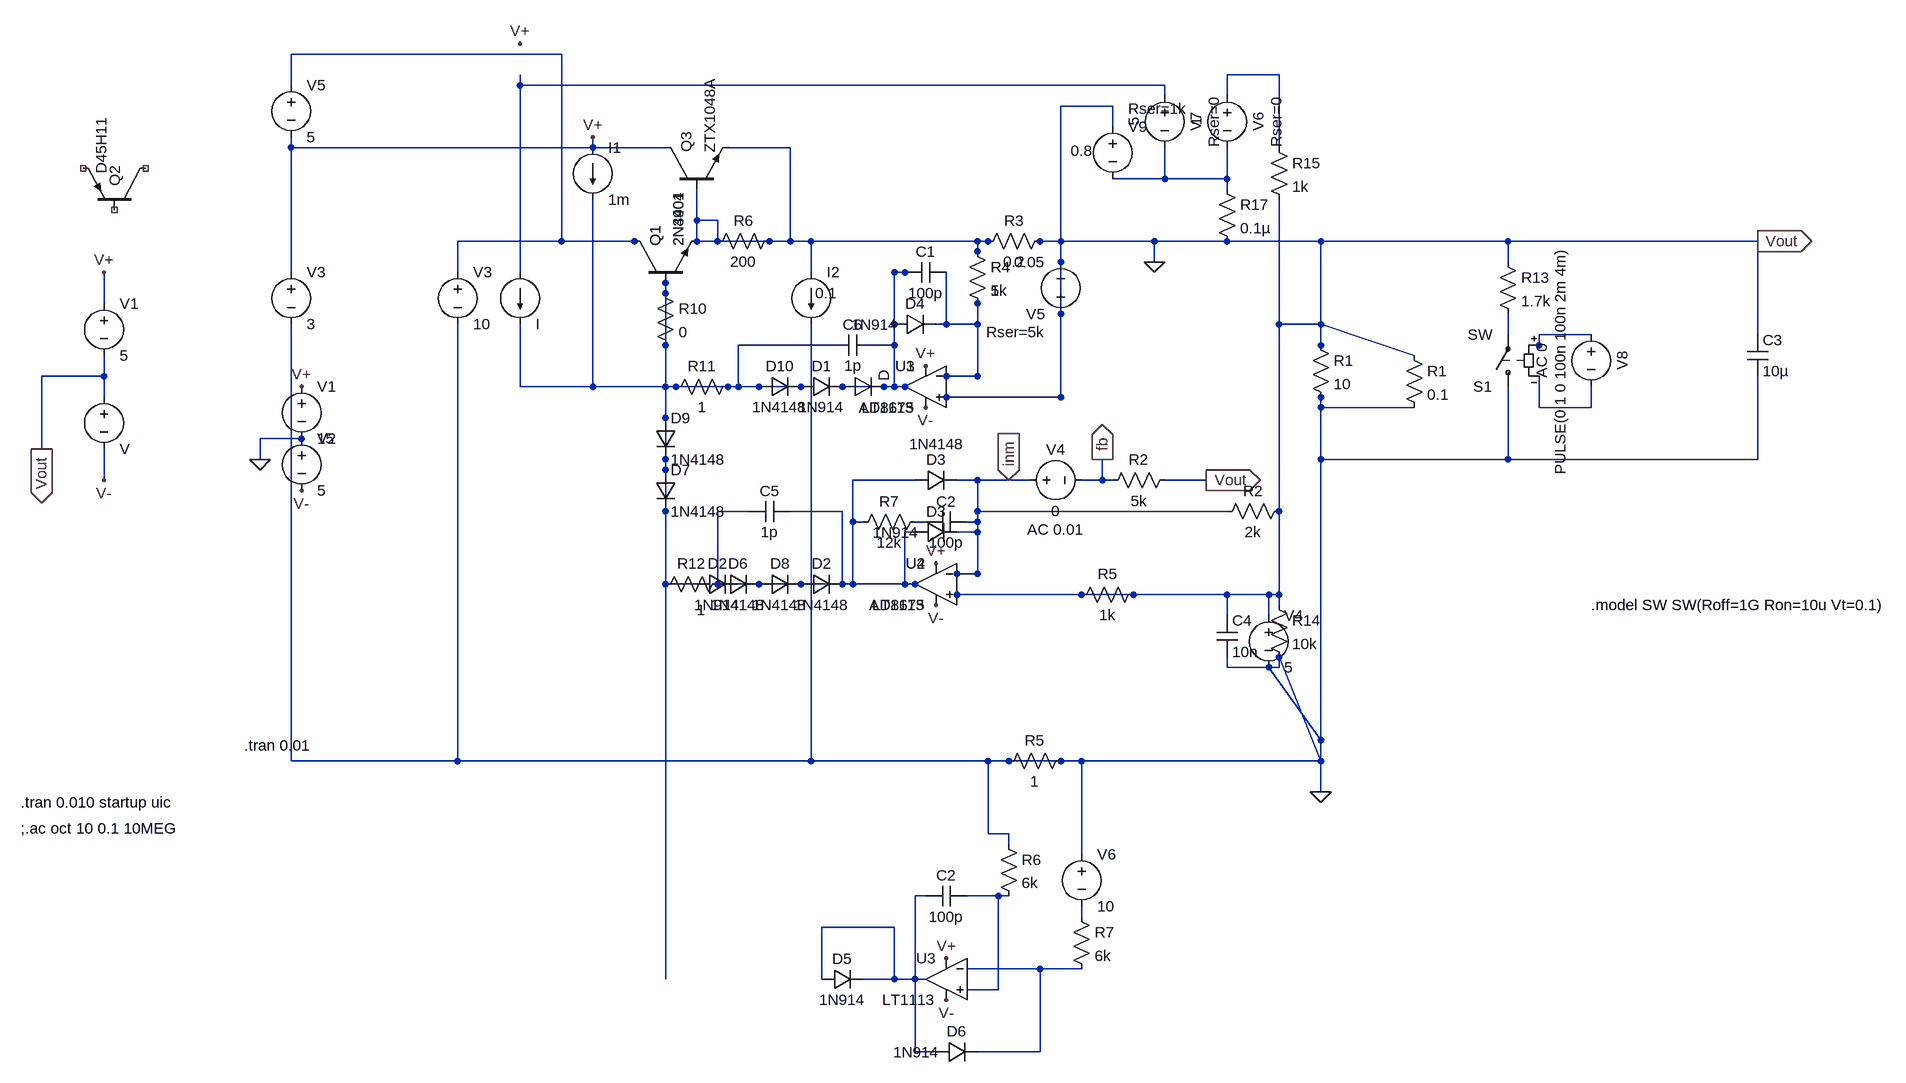
[diagram p0: schematic blackdog_experiments.asc]
blackdog_experiments.asc, the LTspice schematic file:
Version 4
<<<<<<< HEAD
SHEET 1 2384 1220
WIRE 96 -416 -320 -416
WIRE 1200 -384 1120 -384
WIRE -320 -368 -320 -416
WIRE 32 -368 32 -384
WIRE 1024 -368 32 -368
WIRE 1024 -352 1024 -368
WIRE 1120 -352 1120 -384
WIRE 944 -336 864 -336
WIRE 944 -304 944 -336
WIRE -320 -272 -320 -288
WIRE 256 -272 -320 -272
WIRE 448 -272 352 -272
WIRE 1200 -272 1200 -384
WIRE 1024 -224 1024 -272
WIRE 1024 -224 944 -224
WIRE 1120 -224 1120 -272
WIRE 1120 -224 1024 -224
WIRE 1120 -208 1120 -224
WIRE 304 -160 304 -208
WIRE 336 -160 304 -160
WIRE 96 -128 96 -416
WIRE 208 -128 96 -128
WIRE 304 -128 304 -160
WIRE 336 -128 336 -160
WIRE 448 -128 448 -272
WIRE 448 -128 416 -128
WIRE 480 -128 448 -128
WIRE 736 -128 480 -128
WIRE 752 -128 736 -128
WIRE 1008 -128 832 -128
WIRE 1120 -128 1008 -128
WIRE 1264 -128 1120 -128
WIRE 1552 -128 1264 -128
WIRE 1936 -128 1552 -128
WIRE 736 -112 736 -128
WIRE 1008 -96 1008 -128
WIRE 1552 -96 1552 -128
WIRE -320 -80 -320 -272
WIRE 32 -80 32 -368
WIRE 480 -80 480 -128
WIRE 624 -80 608 -80
WIRE 256 -48 256 -64
WIRE -608 -32 -608 -80
=======
SHEET 1 1332 1220
WIRE 144 -272 144 -288
WIRE 208 -128 -64 -128
WIRE 736 -128 304 -128
WIRE 752 -128 736 -128
WIRE 864 -128 832 -128
WIRE 1264 -128 864 -128
WIRE 736 -112 736 -128
WIRE 864 -96 864 -128
WIRE -64 -80 -64 -128
WIRE 624 -80 608 -80
>>>>>>> 6c758090dd1eeeb20fed47f8386ac39ac4c47e26
WIRE 608 0 608 -80
WIRE 688 0 688 -80
WIRE 688 0 672 0
WIRE 736 0 736 -32
WIRE 736 0 688 0
WIRE 1264 0 1264 -128
<<<<<<< HEAD
WIRE 1552 16 1552 -16
WIRE 1680 16 1600 16
WIRE 1936 16 1936 -128
WIRE 512 32 368 32
WIRE 608 32 608 0
WIRE 608 32 576 32
WIRE 1264 32 1264 0
WIRE 1600 32 1600 16
WIRE 1600 32 1584 32
WIRE 1408 48 1264 0
WIRE -608 80 -608 48
WIRE -608 80 -704 80
WIRE 736 80 736 0
WIRE 736 80 688 80
WIRE 32 96 32 0
WIRE 256 96 256 32
WIRE 256 96 32 96
WIRE 272 96 256 96
WIRE 368 96 368 32
WIRE 368 96 352 96
WIRE 400 96 368 96
WIRE 608 96 608 32
WIRE 608 96 592 96
WIRE 624 96 608 96
WIRE -608 112 -608 80
WIRE 864 112 864 -336
WIRE 864 112 688 112
WIRE 1264 128 1264 112
WIRE 1408 128 1264 128
WIRE 1600 128 1600 80
WIRE 1680 128 1680 96
WIRE 1680 128 1600 128
WIRE 256 144 256 96
WIRE -704 192 -704 80
WIRE 1264 208 1264 128
WIRE 1552 208 1552 96
WIRE 1552 208 1264 208
WIRE 1936 208 1936 80
WIRE 1936 208 1552 208
WIRE 256 224 256 208
WIRE -608 240 -608 192
WIRE 640 240 544 240
WIRE 736 240 704 240
WIRE 784 240 736 240
WIRE 816 240 784 240
WIRE 928 240 928 208
WIRE 928 240 896 240
WIRE 944 240 928 240
WIRE 1088 240 1024 240
WIRE 384 288 336 288
WIRE 528 288 448 288
WIRE 544 304 544 240
WIRE 560 304 544 304
WIRE 656 304 640 304
WIRE 736 304 736 240
WIRE 736 304 720 304
WIRE 736 384 736 304
WIRE 736 384 704 384
WIRE 256 400 256 288
WIRE 336 400 336 288
WIRE 528 400 528 288
WIRE 544 400 544 304
WIRE 544 400 528 400
WIRE 640 400 544 400
WIRE 896 416 704 416
WIRE 1120 416 976 416
WIRE 1200 416 1200 -192
WIRE 1200 416 1120 416
WIRE 1200 432 1200 416
WIRE 1120 448 1120 416
WIRE 1120 528 1120 512
WIRE 1200 528 1200 512
WIRE 1200 528 1120 528
WIRE -320 672 -320 0
WIRE 480 672 480 0
WIRE 480 672 -320 672
WIRE 1264 672 1264 208
WIRE 1264 672 1200 512
WIRE 1264 672 480 672
WIRE 1264 720 1264 672
FLAG -608 -80 V+
FLAG -608 240 V-
FLAG 32 -432 V+
=======
WIRE 1264 0 1200 0
WIRE 1264 32 1264 0
WIRE 736 80 736 0
WIRE 736 80 688 80
WIRE 144 96 144 -192
WIRE 256 96 256 -64
WIRE 256 96 144 96
WIRE 464 96 256 96
WIRE 608 96 608 0
WIRE 608 96 528 96
WIRE 624 96 608 96
WIRE 864 112 864 -16
WIRE 864 112 688 112
WIRE -304 176 -368 176
WIRE -368 208 -368 176
WIRE 1120 288 736 288
WIRE 1200 288 1200 0
WIRE 640 320 624 320
WIRE 736 320 736 288
WIRE 736 320 704 320
WIRE 736 384 736 320
WIRE 736 384 704 384
WIRE 256 400 256 96
WIRE 304 400 256 400
WIRE 624 400 624 320
WIRE 624 400 368 400
WIRE 640 400 624 400
WIRE 1184 416 704 416
WIRE 1184 448 1184 416
WIRE 1264 640 1264 112
WIRE 1264 640 1184 528
WIRE -64 672 -64 0
WIRE 752 672 -64 672
WIRE 784 672 752 672
WIRE 896 672 864 672
WIRE 1264 672 1264 640
WIRE 1264 672 896 672
WIRE 1264 720 1264 672
WIRE 752 784 752 672
WIRE 784 784 752 784
WIRE 784 800 784 784
WIRE 896 816 896 672
WIRE 656 880 640 880
WIRE 768 880 720 880
WIRE 784 880 768 880
WIRE 896 912 896 896
WIRE 608 928 496 928
WIRE 832 992 720 992
WIRE 896 992 832 992
WIRE 256 1008 256 400
WIRE 496 1008 496 928
WIRE 608 1008 608 928
WIRE 608 1008 560 1008
WIRE 640 1008 640 880
WIRE 640 1008 608 1008
WIRE 656 1008 640 1008
WIRE 768 1024 768 880
WIRE 768 1024 720 1024
WIRE 640 1120 640 1008
WIRE 672 1120 640 1120
WIRE 832 1120 832 992
WIRE 832 1120 736 1120
FLAG -368 208 0
FLAG -304 96 V+
FLAG -304 256 V-
FLAG 144 -288 V+
FLAG 1264 720 0
>>>>>>> 6c758090dd1eeeb20fed47f8386ac39ac4c47e26
FLAG 656 64 V+
FLAG 672 368 V+
FLAG 672 432 V-
FLAG 656 128 V-
<<<<<<< HEAD
FLAG 928 208 fb
IOPIN 928 208 Out
FLAG 784 240 inm
IOPIN 784 240 In
FLAG 1936 -128 Vout
IOPIN 1936 -128 Out
FLAG -704 192 Vout
IOPIN -704 192 Out
FLAG 1088 240 Vout
IOPIN 1088 240 Out
FLAG 1008 -96 0
SYMBOL voltage -608 -48 R0
WINDOW 123 0 0 Left 0
WINDOW 39 0 0 Left 0
SYMATTR InstName V1
SYMATTR Value 5
SYMBOL voltage -608 96 R0
=======
FLAG 688 976 V+
FLAG 688 1040 V-
SYMBOL voltage -304 80 R0
WINDOW 123 0 0 Left 0
WINDOW 39 0 0 Left 0
SYMATTR InstName V1
SYMATTR Value 15
SYMBOL voltage -304 160 R0
>>>>>>> 6c758090dd1eeeb20fed47f8386ac39ac4c47e26
WINDOW 123 0 0 Left 0
WINDOW 39 0 0 Left 0
SYMATTR InstName V2
SYMATTR Value 5
<<<<<<< HEAD
SYMBOL npn 208 -64 R270
SYMATTR InstName Q1
SYMATTR Value 2N4401
SYMBOL voltage -320 -96 R0
WINDOW 123 0 0 Left 0
WINDOW 39 0 0 Left 0
SYMATTR InstName V3
SYMATTR Value 3
SYMBOL current 32 -80 R0
=======
SYMBOL Opamps\\LT1113 656 32 M0
SYMATTR InstName U1
SYMBOL Opamps\\LT1113 672 336 M0
SYMATTR InstName U2
SYMBOL npn 208 -64 R270
SYMATTR InstName Q1
SYMATTR Value 2N3904
SYMBOL voltage -64 -96 R0
WINDOW 123 0 0 Left 0
WINDOW 39 0 0 Left 0
SYMATTR InstName V3
SYMATTR Value 10
SYMBOL current 144 -272 R0
>>>>>>> 6c758090dd1eeeb20fed47f8386ac39ac4c47e26
WINDOW 123 0 0 Left 0
WINDOW 39 0 0 Left 0
SYMATTR InstName I1
SYMATTR Value 1m
SYMBOL diode 464 112 R270
WINDOW 0 32 32 VTop 2
WINDOW 3 0 32 VBottom 2
SYMATTR InstName D1
SYMATTR Value 1N914
<<<<<<< HEAD
SYMBOL diode 464 416 R270
WINDOW 0 32 32 VTop 2
WINDOW 3 0 32 VBottom 2
SYMATTR InstName D2
SYMATTR Value 1N4148
SYMBOL res 1392 32 R0
SYMATTR InstName R1
SYMATTR Value 0.1
SYMBOL diode 640 256 R270
WINDOW 0 32 32 VTop 2
WINDOW 3 87 33 VBottom 2
SYMATTR InstName D3
SYMATTR Value 1N4148
SYMBOL res 1040 224 R90
WINDOW 0 0 56 VBottom 2
WINDOW 3 32 56 VTop 2
SYMATTR InstName R2
SYMATTR Value 5k
=======
SYMBOL diode 304 416 R270
WINDOW 0 32 32 VTop 2
WINDOW 3 0 32 VBottom 2
SYMATTR InstName D2
SYMATTR Value 1N914
SYMBOL res 1248 16 R0
SYMATTR InstName R1
SYMATTR Value 10
SYMBOL voltage 1184 432 R0
WINDOW 123 0 0 Left 0
WINDOW 39 0 0 Left 0
SYMATTR InstName V4
SYMATTR Value 5
SYMBOL diode 640 336 R270
WINDOW 0 32 32 VTop 2
WINDOW 3 31 -30 VBottom 2
SYMATTR InstName D3
SYMATTR Value 1N914
SYMBOL res 1216 272 R90
WINDOW 0 0 56 VBottom 2
WINDOW 3 32 56 VTop 2
SYMATTR InstName R2
SYMATTR Value 2k
>>>>>>> 6c758090dd1eeeb20fed47f8386ac39ac4c47e26
SYMBOL res 736 -112 R270
WINDOW 0 32 56 VTop 2
WINDOW 3 0 56 VBottom 2
SYMATTR InstName R3
<<<<<<< HEAD
SYMATTR Value 0.2
SYMBOL res 720 -128 R0
SYMATTR InstName R4
SYMATTR Value 1k
=======
SYMATTR Value 1
SYMBOL res 720 -128 R0
SYMATTR InstName R4
SYMATTR Value 5k
SYMBOL voltage 864 0 R180
WINDOW 123 0 0 Left 0
WINDOW 39 24 -12 Left 2
SYMATTR SpiceLine Rser=5k
SYMATTR InstName V5
SYMATTR Value 0.05
>>>>>>> 6c758090dd1eeeb20fed47f8386ac39ac4c47e26
SYMBOL diode 608 16 R270
WINDOW 0 32 32 VTop 2
WINDOW 3 31 -30 VBottom 2
SYMATTR InstName D4
SYMATTR Value 1N914
SYMBOL cap 688 -96 R90
WINDOW 0 0 32 VBottom 2
WINDOW 3 32 32 VTop 2
SYMATTR InstName C1
SYMATTR Value 100p
<<<<<<< HEAD
SYMBOL pnp -544 -176 M270
WINDOW 0 36 47 Left 2
SYMATTR InstName Q2
SYMATTR Value D45H11
SYMBOL res 240 -64 R0
SYMATTR InstName R10
SYMATTR Value 0
SYMBOL res 368 80 R90
WINDOW 0 0 56 VBottom 2
WINDOW 3 32 56 VTop 2
SYMATTR InstName R11
SYMATTR Value 1
SYMBOL res 352 384 R90
WINDOW 0 0 56 VBottom 2
WINDOW 3 40 41 VTop 2
SYMATTR InstName R12
SYMATTR Value 1
SYMBOL cap 1920 16 R0
SYMATTR InstName C3
SYMATTR Value 10µ
SYMATTR SpiceLine Rser=0.1
SYMBOL Opamps\\AD8675 656 32 M0
SYMATTR InstName U3
SYMBOL Opamps\\AD8675 672 336 M0
SYMATTR InstName U4
SYMBOL res 656 288 R90
WINDOW 0 0 56 VBottom 2
WINDOW 3 32 56 VTop 2
SYMATTR InstName R7
SYMATTR Value 12k
SYMBOL cap 720 288 R90
WINDOW 0 0 32 VBottom 2
WINDOW 3 32 32 VTop 2
SYMATTR InstName C2
SYMATTR Value 100p
SYMBOL voltage 800 240 R270
WINDOW 0 32 56 VTop 2
WINDOW 3 -32 56 VBottom 2
WINDOW 123 -60 56 VBottom 2
WINDOW 39 0 0 Left 0
SYMATTR InstName V4
SYMATTR Value 0
SYMATTR Value2 AC 0.01
SYMBOL voltage 1120 -368 R0
WINDOW 0 32 56 VTop 2
WINDOW 3 -32 56 VBottom 2
WINDOW 123 -60 56 VBottom 2
WINDOW 39 60 56 VTop 2
SYMATTR InstName V6
SYMATTR Value 1
SYMATTR SpiceLine Rser=0
SYMBOL current 480 -80 R0
WINDOW 3 6 32 Left 2
WINDOW 123 0 0 Left 0
WINDOW 39 0 0 Left 0
SYMATTR Value 0.1
SYMATTR InstName I2
SYMBOL sw 1552 112 R180
SYMATTR InstName S1
SYMBOL voltage 1680 0 R0
WINDOW 0 32 56 VTop 2
WINDOW 3 -32 56 VBottom 2
WINDOW 123 -60 56 VBottom 2
WINDOW 39 0 0 Left 0
SYMATTR InstName V8
SYMATTR Value PULSE(0 1 0 100n 100n 2m 4m)
SYMATTR Value2 AC 0
SYMBOL res 1536 -112 R0
SYMATTR InstName R13
SYMATTR Value 1.7k
SYMBOL res 1184 -288 R0
SYMATTR InstName R15
SYMATTR Value 1k
SYMBOL res 1184 416 R0
SYMATTR InstName R14
SYMATTR Value 10k
SYMBOL diode 336 416 R270
WINDOW 0 32 32 VTop 2
WINDOW 3 0 32 VBottom 2
SYMATTR InstName D6
SYMATTR Value 1N4148
SYMBOL voltage 1024 -368 R0
WINDOW 0 32 56 VTop 2
WINDOW 3 -32 56 VBottom 2
WINDOW 123 -60 56 VBottom 2
WINDOW 39 60 56 VTop 2
SYMATTR InstName V7
SYMATTR Value 5
SYMATTR SpiceLine Rser=0
SYMBOL res 1104 -224 R0
SYMATTR InstName R17
SYMATTR Value 0.1µ
SYMBOL voltage 944 -320 R0
WINDOW 123 0 0 Left 0
WINDOW 39 24 -12 Left 2
WINDOW 3 -65 53 Left 2
SYMATTR SpiceLine Rser=1k
SYMATTR Value 0.8
SYMATTR InstName V9
SYMBOL diode 400 416 R270
WINDOW 0 32 32 VTop 2
WINDOW 3 0 32 VBottom 2
SYMATTR InstName D8
SYMATTR Value 1N4148
SYMBOL diode 528 112 R270
=======
SYMBOL res 880 656 R90
WINDOW 0 0 56 VBottom 2
WINDOW 3 32 56 VTop 2
SYMATTR InstName R5
SYMATTR Value 1
SYMBOL Opamps\\LT1113 688 944 M0
SYMATTR InstName U3
SYMBOL diode 496 1024 R270
>>>>>>> 6c758090dd1eeeb20fed47f8386ac39ac4c47e26
WINDOW 0 32 32 VTop 2
WINDOW 3 0 32 VBottom 2
SYMATTR InstName D5
SYMATTR Value 1N914
<<<<<<< HEAD
SYMBOL cap 1104 448 R0
SYMATTR InstName C4
SYMATTR Value 10n
SYMBOL npn 256 -208 R270
SYMATTR InstName Q3
SYMATTR Value ZTX1048A
SYMBOL res 432 -144 R90
WINDOW 0 0 56 VBottom 2
WINDOW 3 32 56 VTop 2
SYMATTR InstName R6
SYMATTR Value 200
SYMBOL diode 240 224 R0
SYMATTR InstName D7
SYMATTR Value 1N4148
SYMBOL diode 240 144 R0
SYMATTR InstName D9
SYMATTR Value 1N4148
SYMBOL voltage -320 -384 R0
WINDOW 123 0 0 Left 0
WINDOW 39 0 0 Left 0
SYMATTR InstName V5
SYMATTR Value 5
SYMBOL cap 448 272 R90
WINDOW 0 0 32 VBottom 2
WINDOW 3 32 32 VTop 2
SYMATTR InstName C5
SYMATTR Value 1p
SYMBOL cap 576 16 R90
WINDOW 0 0 32 VBottom 2
WINDOW 3 32 32 VTop 2
SYMATTR InstName C6
SYMATTR Value 1p
SYMBOL res 992 400 R90
WINDOW 0 0 56 VBottom 2
WINDOW 3 32 56 VTop 2
SYMATTR InstName R5
SYMATTR Value 1k
SYMBOL diode 400 112 R270
WINDOW 0 32 32 VTop 2
WINDOW 3 0 32 VBottom 2
SYMATTR InstName D10
SYMATTR Value 1N4148
TEXT -736 736 Left 2 !.tran 0.010 startup uic
TEXT -736 776 Left 2 !;.ac oct 10 0.1 10MEG
TEXT 1680 432 Left 2 !.model SW SW(Roff=1G Ron=10u Vt=0.1)
=======
SYMBOL voltage 896 800 R0
WINDOW 123 0 0 Left 0
WINDOW 39 0 0 Left 0
SYMATTR InstName V6
SYMATTR Value 10
SYMBOL cap 720 864 R90
WINDOW 0 0 32 VBottom 2
WINDOW 3 32 32 VTop 2
SYMATTR InstName C2
SYMATTR Value 100p
SYMBOL res 768 784 R0
SYMATTR InstName R6
SYMATTR Value 6k
SYMBOL diode 672 1136 R270
WINDOW 0 32 32 VTop 2
WINDOW 3 31 -30 VBottom 2
SYMATTR InstName D6
SYMATTR Value 1N914
SYMBOL res 880 896 R0
SYMATTR InstName R7
SYMATTR Value 6k
TEXT -392 648 Left 2 !.tran 0.01
>>>>>>> 6c758090dd1eeeb20fed47f8386ac39ac4c47e26

The netlist it stands for:
* blackdog_experiments.asc
V1 V+ 0 5
V§? 0 V- V
V1 V+ 0 15
V2 0 V- 5
Q1 N001 N007 N004 0 2N4401
V3 V+ 0 3
I§? N003 N007 I
XU1 0 N008 V+ V- N006 LT1113  ; pins In+ In- V+ V- OUT
XU2 0 inm V+ V- N012 LT1113  ; pins In+ In- V+ V- OUT
Q1 N001 N007 N004 0 2N3904
V3 N001 0 10
I1 V+ N007 1m
D1 N007 N006 1N914
D2 N012 N012 1N4148
R1 0 0 0.1
D3 N012 inm 1N4148
R2 0 fb 5k
D2 N007 N012 1N914
R1 0 0 10
V4 0 0 5
D3 N012 inm 1N914
R2 0 inm 2k
R3 N004 0 0.2
R4 N004 N008 1
R4 N004 N008 5k
V5 0 0 0.05 Rser=5k
D4 N006 N008 1N914
C1 N008 N006 100p
Q2 NC_01 NC_02 NC_03 0 D45H11
R10 N007 N007 0
R11 N007 N007 1
R12 N013 N007 1
C3 0 0 10µ Rser=0.1
XU3 0 N008 V+ V- N006 AD8675  ; pins In+ In- V+ V- OUT
XU4 0 inm V+ V- N012 AD8675  ; pins In+ In- V+ V- OUT
R7 N014 N012 12k
C2 inm N014 100p
V4 inm fb 0 AC 0.01
V6 N002 N005 1 Rser=0
I2 N004 0 0.1
S1 0 N009 N010 N011 SW
V8 N010 N011 PULSE(0 1 0 100n 100n 2m 4m) AC 0
R13 0 N009 1.7k
R15 N002 0 1k
R14 0 0 10k
D6 N013 N012 1N4148
V7 N003 N005 5 Rser=0
R17 N005 0 0.1µ
V9 0 N005 0.8 Rser=1k
D8 N012 N012 1N4148
D§? N006 N006 D
R5 0 0 1
XU3 N016 N018 V+ V- N015 LT1113  ; pins In+ In- V+ V- OUT
D5 N015 N015 1N914
C4 0 0 10n
Q3 V+ N004 N004 0 ZTX1048A
R6 N004 N004 200
D7 N007 N007 1N4148
D9 N007 N007 1N4148
V5 N001 V+ 5
C5 N012 N013 1p
C6 N006 N007 1p
R5 0 0 1k
D10 N007 N007 1N4148
V6 0 N017 10
C2 N016 N015 100p
R6 0 N016 6k
D6 N015 N018 1N914
R7 N017 N018 6k
.model D D
.lib standard.dio
.model NPN NPN
.model PNP PNP
.lib standard.bjt
.tran 0.010 startup uic
;.ac oct 10 0.1 10MEG
.model SW SW(Roff=1G Ron=10u Vt=0.1)
.tran 0.01
.backanno
.end